# Altium schematic sheet PTMe-stop.SchDoc
size A4
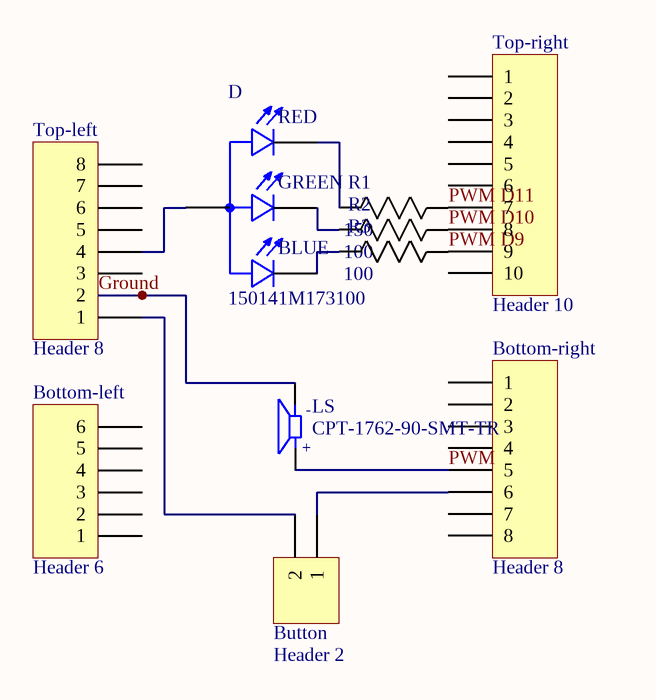
[diagram p0: PTMe-stop.SchDoc]

## Parts
Bottom-left  Header 6  [HDR1X6]
Bottom-right  Header 8  [HDR1X8]
Button  Header 2  [HDR1X2]
D  150141M173100  [LED_150141M173100]
LS  CPT-1762-90-SMT-TR  [XDCR_CPT-1762-90-SMT-TR]
R1  150  [0805]
R2  100  [0805]
R3  100  [0805]
Top-left  Header 8  [HDR1X8]
Top-right  Header 10  [HDR1X10]

## Nets
Ground: LS.N Top-left.2
PWM: Bottom-right.5 LS.P
PWM D9: R3.1(R1) Top-right.9
PWM D10: R2.1(R1) Top-right.8
PWM D11: R1.1(R1) Top-right.7
NetBottom-right_6: Bottom-right.6 Button.1
NetButton_2: Button.2 Top-left.1
NetD_1: D.1(A) Top-left.4
NetD_2: D.2(B_C) R3.2(R2)
NetD_3: D.3(R_C) R1.2(R2)
NetD_4: D.4(G_C) R2.2(R2)

Not connected (* = marked no-connect by the designer): Bottom-left 1 2 3 4 5 6; Bottom-right 1 2 3 4 7 8; Top-left 3 5 6 7 8; Top-right 1 2 3 4 5 6 10

## Notes on the sheet
- (in symbol 150141M173100) RED; GREEN; BLUE
- (in symbol CPT-1762-90-SMT-TR) -; +

## Library data of the parts
Bottom-left = Header 6: Header, 6-Pin; LatestRevisionDate: 17-Jul-2002; LatestRevisionNote: Re-released for DXP Platform.; Publisher: Altium Limited
Bottom-right Top-left = Header 8: Header, 8-Pin; LatestRevisionDate: 17-Jul-2002; LatestRevisionNote: Re-released for DXP Platform.; Publisher: Altium Limited
Button = Header 2: Header, 2-Pin; LatestRevisionDate: 17-Jul-2002; LatestRevisionNote: Re-released for DXP Platform.; Publisher: Altium Limited
D = 150141M173100: Red, Green, Blue _RGB_ 625nm Red, 520nm Green, 470nm Blue LED Indication - Discrete 2V Red, 3.2V Green, 3.2V Blue 1411 _3528 Metric_; MF: Wurth Electronics; SnapEDA_Link: https://www.snapeda.com/parts/150141M173100/Wurth%20Electronics%20Inc./view-part/281733/?ref=snap; Price: None; MP: 150141M173100; Package: 1411 WÃ¼rth Elektronik; Value: *; Availability: Unavailable
LS = CPT-1762-90-SMT-TR: 17 mm, 12 Vp-p, 90 dB, Surface Mount, Piezo Audio Transducer Buzzer; MF: CUI Devices; CUI_purchase_URL: https://www.cuidevices.com/product/audio/buzzers/audio-transducers/cpt-1762-90-smt-tr?utm_source=snapeda.com&utm_medium=referral&utm_campaign=snapedaBOM; Price: None; SnapEDA_Link: https://www.snapeda.com/parts/CPT-1762-90-SMT-TR/CUI%20Devices/view-part/4502169/?ref=snap; Availability: Unavailable; Value: *; MP: CPT-1762-90-SMT-TR; Package: CUI Devices
R1 = RES 150.0 1/8W: RES SMD 150 OHM 5% 1/8W 0805; Power (Watts): 0.125W; Package: 0805; Value: 150; Tolerance: 5%
R2 R3 = RES 100.0 1/8W: RES SMD 100 OHM 5% 1/8W 0805; Power (Watts): 0.125W; Package: 0805; Value: 100; Tolerance: 5%
Top-right = Header 10: Header, 10-Pin; LatestRevisionDate: 17-Jul-2002; LatestRevisionNote: Re-released for DXP Platform.; Publisher: Altium Limited